# Altium schematic sheet primary_LTC.SchDoc: foxBMS BMS-Slave 12-Cell
size A3; DocumentNumber: 15; SheetNumber: 15; SheetTotal: 21; AUTHOR: Fraunhofer IISB foxBMS Team; SheetDescription: Primary LTC6811
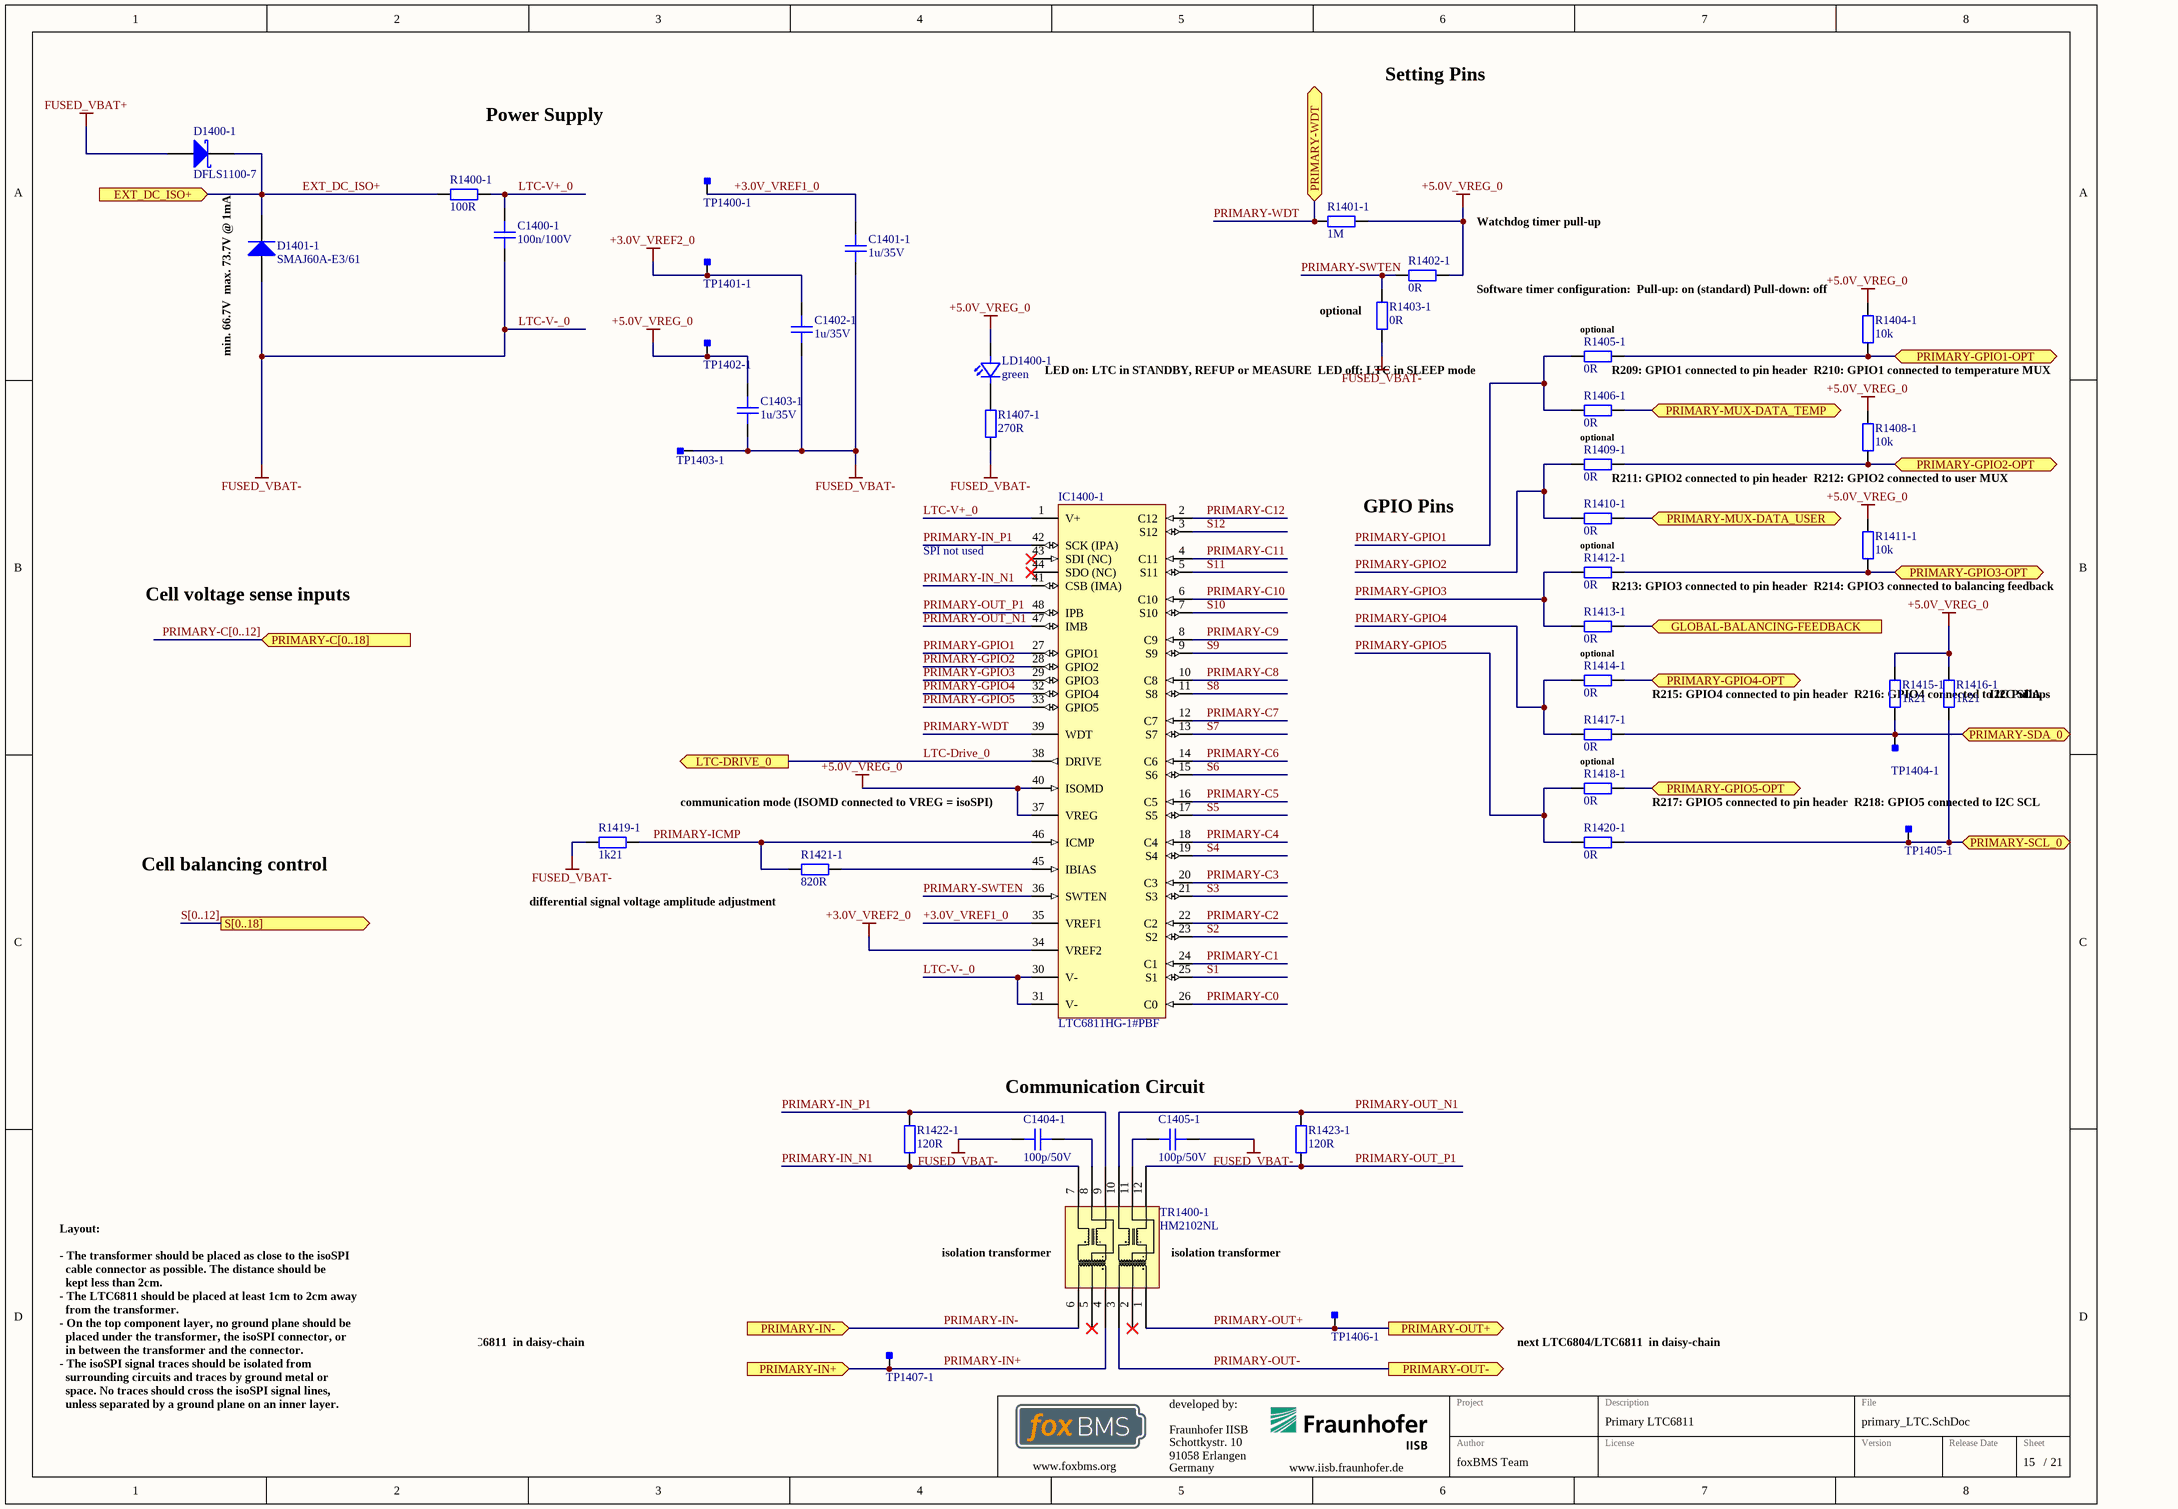
[diagram p0: primary_LTC.SchDoc]

## Parts
C1400-1  100n/100V  [CAPC2012X14N]
C1401-1  1u/35V  [CAPC1608X08N]
C1402-1  1u/35V  [CAPC1608X08N]
C1403-1  1u/35V  [CAPC1608X08N]
C1404-1  100p/50V  [CAPC1608X08N]
C1405-1  100p/50V  [CAPC1608X08N]
D1400-1  DFLS1100-7  [DIOD-POWERDI123-2_V]
D1401-1  SMAJ60A-E3/61  [VISH-DO-214AC-2_N]
IC1400-1  LTC6811HG-1#PBF  [LT-G-48_L]
LD1400-1  green  [LEDC1608X07N]
R1400-1  100R  [RESC2012X05N]
R1401-1  1M  [RESC1608X05N]
R1402-1  0R  [RESC1608X05N]
R1403-1  0R  [RESC1608X05N]
R1404-1  10k  [RESC1608X05N]
R1405-1  0R  [RESC1608X05N]
R1406-1  0R  [RESC1608X05N]
R1407-1  270R  [RESC1608X05N]
R1408-1  10k  [RESC1608X05N]
R1409-1  0R  [RESC1608X05N]
R1410-1  0R  [RESC1608X05N]
R1411-1  10k  [RESC1608X05N]
R1412-1  0R  [RESC1608X05N]
R1413-1  0R  [RESC1608X05N]
R1414-1  0R  [RESC1608X05N]
R1415-1  1k21  [RESC1608X05N]
R1416-1  1k21  [RESC1608X05N]
R1417-1  0R  [RESC1608X05N]
R1418-1  0R  [RESC1608X05N]
R1419-1  1k21  [RESC1608X05N]
R1420-1  0R  [RESC1608X05N]
R1421-1  820R  [RESC1608X05N]
R1422-1  120R  [RESC1608X05N]
R1423-1  120R  [RESC1608X05N]
TP1400-1  Testpoint_Square  [Testpoint_S1]  (value not drawn)  (no BOM)
TP1401-1  Testpoint_Square  [Testpoint_S1]  (value not drawn)  (no BOM)
TP1402-1  Testpoint_Square  [Testpoint_S1]  (value not drawn)  (no BOM)
TP1403-1  Testpoint_Square  [Testpoint_S1]  (value not drawn)  (no BOM)
TP1404-1  Testpoint_Square  [Testpoint_S1]  (value not drawn)  (no BOM)
TP1405-1  Testpoint_Square  [Testpoint_S1]  (value not drawn)  (no BOM)
TP1406-1  Testpoint_Square  [Testpoint_S1]  (value not drawn)  (no BOM)
TP1407-1  Testpoint_Square  [Testpoint_S1]  (value not drawn)  (no BOM)
TR1400-1  HM2102NL  [HM2102NL]

## Ports
EXT_DC_ISO+ (in), GLOBAL-BALANCING-FEEDBACK (in), LTC-DRIVE_0 (out), PRIMARY-C[0..18] (in), PRIMARY-GPIO1-OPT (bidir), PRIMARY-GPIO2-OPT (bidir), PRIMARY-GPIO3-OPT (bidir), PRIMARY-GPIO4-OPT (bidir), PRIMARY-GPIO5-OPT (bidir), PRIMARY-IN+ (in), PRIMARY-IN- (in), PRIMARY-MUX-DATA_TEMP (bidir), PRIMARY-MUX-DATA_USER (bidir), PRIMARY-OUT+ (out), PRIMARY-OUT- (out), PRIMARY-SCL_0 (bidir), PRIMARY-SDA_0 (bidir), PRIMARY-WDT (bidir), S[0..18] (out)

## Nets
+3.0V_VREF2_0: C1402-1.2 IC1400-1.34(VREF2) TP1401-1.1
+5.0V_VREG_0: C1403-1.2 IC1400-1.37(VREG) IC1400-1.40(ISOMD) LD1400-1.2(A) R1401-1.2 R1402-1.2 R1404-1.2 R1408-1.2 R1411-1.2 R1415-1.2 R1416-1.2 TP1402-1.1
FUSED_VBAT+: D1400-1.1(A)
LTC-V-_0: C1400-1.2 C1401-1.1 C1402-1.1 C1403-1.1 C1404-1.1 C1405-1.1 D1401-1.2(A) IC1400-1.30(V-) IC1400-1.31(V-) R1403-1.1 R1407-1.1 R1419-1.1 TP1403-1.1  [also labelled FUSED_VBAT-]
+3.0V_VREF1_0: C1401-1.2 IC1400-1.35(VREF1) TP1400-1.1
EXT_DC_ISO+: D1400-1.2(K) D1401-1.1(K) R1400-1.1 ; port EXT_DC_ISO+
GLOBAL-BALANCING-FEEDBACK: R1413-1.1 ; port GLOBAL-BALANCING-FEEDBACK
LTC-Drive_0: IC1400-1.38(DRIVE) ; port LTC-DRIVE_0
LTC-V+_0: C1400-1.1 IC1400-1.1(V+) R1400-1.2
PRIMARY-C0: IC1400-1.26(C0)
PRIMARY-C1: IC1400-1.24(C1)
PRIMARY-C2: IC1400-1.22(C2)
PRIMARY-C3: IC1400-1.20(C3)
PRIMARY-C4: IC1400-1.18(C4)
PRIMARY-C5: IC1400-1.16(C5)
PRIMARY-C6: IC1400-1.14(C6)
PRIMARY-C7: IC1400-1.12(C7)
PRIMARY-C8: IC1400-1.10(C8)
PRIMARY-C9: IC1400-1.8(C9)
PRIMARY-C10: IC1400-1.6(C10)
PRIMARY-C11: IC1400-1.4(C11)
PRIMARY-C12: IC1400-1.2(C12)
PRIMARY-GPIO1: IC1400-1.27(GPIO1) R1405-1.2 R1406-1.2
PRIMARY-GPIO1-OPT: R1404-1.1 R1405-1.1 ; port PRIMARY-GPIO1-OPT
PRIMARY-GPIO2: IC1400-1.28(GPIO2) R1409-1.2 R1410-1.2
PRIMARY-GPIO2-OPT: R1408-1.1 R1409-1.1 ; port PRIMARY-GPIO2-OPT
PRIMARY-GPIO3: IC1400-1.29(GPIO3) R1412-1.2 R1413-1.2
PRIMARY-GPIO3-OPT: R1411-1.1 R1412-1.1 ; port PRIMARY-GPIO3-OPT
PRIMARY-GPIO4: IC1400-1.32(GPIO4) R1414-1.2 R1417-1.2
PRIMARY-GPIO4-OPT: R1414-1.1 ; port PRIMARY-GPIO4-OPT
PRIMARY-GPIO5: IC1400-1.33(GPIO5) R1418-1.2 R1420-1.2
PRIMARY-GPIO5-OPT: R1418-1.1 ; port PRIMARY-GPIO5-OPT
PRIMARY-ICMP: IC1400-1.46(ICMP) R1419-1.2 R1421-1.1
PRIMARY-IN+: TP1407-1.1 TR1400-1.4 ; port PRIMARY-IN+
PRIMARY-IN-: TR1400-1.6 ; port PRIMARY-IN-
PRIMARY-IN_N1: IC1400-1.41(CSB_(IMA)) R1422-1.2 TR1400-1.7
PRIMARY-IN_P1: IC1400-1.42(SCK_(IPA)) R1422-1.1 TR1400-1.9
PRIMARY-MUX-DATA_TEMP: R1406-1.1 ; port PRIMARY-MUX-DATA_TEMP
PRIMARY-MUX-DATA_USER: R1410-1.1 ; port PRIMARY-MUX-DATA_USER
PRIMARY-OUT+: TP1406-1.1 TR1400-1.1 ; port PRIMARY-OUT+
PRIMARY-OUT-: TR1400-1.3 ; port PRIMARY-OUT-
PRIMARY-OUT_N1: IC1400-1.47(IMB) R1423-1.2 TR1400-1.10
PRIMARY-OUT_P1: IC1400-1.48(IPB) R1423-1.1 TR1400-1.12
PRIMARY-SCL_0: R1416-1.1 R1420-1.1 TP1405-1.1 ; port PRIMARY-SCL_0
PRIMARY-SDA_0: R1415-1.1 R1417-1.1 TP1404-1.1 ; port PRIMARY-SDA_0
PRIMARY-SWTEN: IC1400-1.36(SWTEN) R1402-1.1 R1403-1.2
PRIMARY-WDT: IC1400-1.39(WDT) R1401-1.1 ; port PRIMARY-WDT
S1: IC1400-1.25(S1)
S2: IC1400-1.23(S2)
S3: IC1400-1.21(S3)
S4: IC1400-1.19(S4)
S5: IC1400-1.17(S5)
S6: IC1400-1.15(S6)
S7: IC1400-1.13(S7)
S8: IC1400-1.11(S8)
S9: IC1400-1.9(S9)
S10: IC1400-1.7(S10)
S11: IC1400-1.5(S11)
S12: IC1400-1.3(S12)
NetC1404-1_2: C1404-1.2 TR1400-1.8
NetC1405-1_2: C1405-1.2 TR1400-1.11
NetIC1400-1_45: IC1400-1.45(IBIAS) R1421-1.2
NetLD1400-1_1: LD1400-1.1(C) R1407-1.2

Not connected (* = marked no-connect by the designer): IC1400-1 43(SDI_(NC))* 44(SDO_(NC))*; TR1400-1 2* 5*

## Buses and harness runs
bus PRIMARY-C[0..12] = port PRIMARY-C[0..18]
bus S[0..12] = port S[0..18]

## Notes on the sheet
- Setting Pins
- Power Supply
- Watchdog timer pull-up
- min. 66.7V
  max. 73.7V @ 1mA
- (near R1403-1) optional
- (near R1404-1) Software timer configuration:
  Pull-up: on (standard)
  Pull-down: off
- LED on: LTC in STANDBY, REFUP or MEASURE
  LED off: LTC in SLEEP mode
- (near R1405-1) optional
- (near R1405-1) R209: GPIO1 connected to pin header
  R210: GPIO1 connected to temperature MUX
- optional
- GPIO Pins
- (near R1409-1) R211: GPIO2 connected to pin header
  R212: GPIO2 connected to user MUX
- SPI not used
- (near R1412-1) R213: GPIO3 connected to pin header
  R214: GPIO3 connected to balancing feedback
- Cell voltage sense inputs
- R215: GPIO4 connected to pin header
  R216: GPIO4 connected to I2C SDA
- (near R1416-1) I2C Pullups
- communication mode (ISOMD connected to VREG = isoSPI)
- (near TP1405-1) R217: GPIO5 connected to pin header
  R218: GPIO5 connected to I2C SCL
- Cell balancing control
- (near R1421-1) differential signal voltage amplitude adjustment
- Communication Circuit
- (near TR1400-1) isolation transformer
- previous LTC6804/LTC6811
  in daisy-chain
- next LTC6804/LTC6811
  in daisy-chain
- Layout:
  - The transformer should be placed as close to the isoSPI
  cable connector as possible. The distance should be
  kept less than 2cm.
  - The LTC6811 should be placed at least 1cm to 2cm away
  from the transformer.
  - On the top component layer, no ground plane should be
  placed under the transformer, the isoSPI connector, or
  in between the transformer and the connector.
  - The isoSPI signal traces should be isolated from
  surrounding circuits and traces by ground metal or
  space. No traces should cross the isoSPI signal lines,
  unless separated by a ground plane on an inner layer.
- Fraunhofer IISB
- Schottkystr. 10
- developed by:
- 91058 Erlangen
- Germany
- Author
- Project
- License
- Description
- File
- Version
- Release Date
- Sheet
- www.foxbms.org
- www.iisb.fraunhofer.de
- foxBMS Team
- /

## Library data of the parts
C1400-1 = gen_C_ceramic_100n_100V_X7R_0805: MLCC; Capacitance: 100n; Rated Voltage: 100V; Dielectric: X7R; Case EIA: 0805; Case Metric: 2012; Automotive Qualified: False; Part Number: gen_C_ceramic_100n_100V_X7R_0805; Supplier 1: Farnell; Supplier Part Number 1: 2320821
C1401-1 C1402-1 C1403-1 = gen_C_ceramic_1u_35V_X7R_0603: MLCC; Capacitance: 1u; Rated Voltage: 35V; Dielectric: X7R; Case EIA: 0603; Case Metric: 1608; PnP Package: C_0603_10; PnP Value: 1uF/35V/X7R; PnP equipped: x; Automotive Qualified: False; Part Number: gen_C_ceramic_1u_35V_X7R_0603; Supplier 1: Farnell; Supplier Part Number 1: 1907508
C1404-1 C1405-1 = gen_C_ceramic_100p_50V_C0G_0603: MLCC; Capacitance: 100p; Rated Voltage: 50V; Dielectric: C0G; Case EIA: 0603; Case Metric: 1608; Automotive Qualified: False; Part Number: gen_C_ceramic_100p_50V_C0G_0603; Supplier 1: Farnell; Supplier Part Number 1: 1414603
D1400-1 = CMP-2000-05099-1: 1 A High Voltage Schottky Barrier Rectifier, 0.62 V, -55 to 175 degC, 2- Pin POWERDI123, Pb-Free, Tape and Reel; Manufacturer: Diodes Inc; Average Rectified Current-Max: 1A; Peak Current-Max: 40A; Forward Voltage: 0.77V; Reverse Current-Max: 1µA; Reverse Voltage-Max [Vrrm]: 100V; Datasheet Version: Sep-14; Datasheet URL: https://datasheet.ciiva.com/15144/getdatasheetpartid-44146-15144126.pdf; Manufacturer URL: http://www.diodes.com/
D1401-1 = CMP-0548-00258-2: Transient Voltage Suppressor, 6.40 to 231 V, 60 V Stand-off Voltage, Uni-Directional, -55 to 155 degC, 2-pin DO-214AC, Pb-Free, Tape and Reel; Manufacturer: Vishay Semiconductor; VWM (V): 60; PPPM (W): 400, 300; VBR Uni-Directional (V): 6.4 to 231; IFSM: 40 A; ID (uA): 1; RoHS: TRUE; ComponentLink3Description: Package Specification; PackageReference: DO-214AC-2; PartNumber: SMAJ60A-E3/61; ComponentLink2Description: Datasheet; ComponentLink2URL: http://www.vishay.com/docs/88390/smaj50a.pdf; ComponentLink3URL: http://www.vishay.com/docs/88390/smaj50a.pdf; Packing: Tape and Reel; ComponentLink1Description: Manufacturer URL; PackageDescription: 2-Pin DO-214AC (SMA), Body 4.245 x 2.665 mm; DatasheetVersion: 12/8/2013; ComponentLink1URL: http://www.vishay.com/; Operating Junction and Storage Temperature Range: -55 to 150 degC; Mounting Technology: Surface Mount
IC1400-1 = LTC6811HG-1#PBF: Multicell Battery Monitor, 60 V Vin MAX, 48-pin SOP (G-48), -40 to 125 degC, Pb-Free; Manufacturer: Linear Technology; Type of Charger: Battery Stack Monitor; Vin Max(V): 60; Battery Chemistry: Li-Ion, Li-Polymer, NiMH; Number of Cells: > 1000 V of stacked Li-Ion cells; Automotive Qualified: False; RoHS: TRUE; ComponentLink1Description: Datasheet; ComponentLink1URL: https://cds.linear.com/docs/en/datasheet/68111fb.pdf; PartNumber: LTC6811HG-1#PBF; PackageReference: G-48; PackageVersion: Rev. Ã˜, 01/2011; ComponentLink2Description: Datasheet; Mounting Technology: Surface Mount; ComponentLink3Description: Package Specification; PackageDescription: 48-Pin Plastic SSOP, Body 12.8 x 5.3 mm, Pitch 0.5 mm; ComponentLink3URL: http://cds.linear.com/docs/en/packaging/05081887_0_G48.pdf; ComponentLink2URL: http://cds.linear.com/docs/en/datasheet/680412f.pdf; Part Number: LTC6811HG-1#PBF; Part Name: LTC6811HG-1#PBF; Operating Temperature: -40°C - +125°C; Supplier 1: Digikey; Supplier Part Number 1: LTC6811HG-1#PBF-ND
LD1400-1 = gen_LED_0603_green: LED; Breakdown Voltage: 5V; Continuous Forward Current: 20mA; Forward Voltage @ 20mA: 2.2V; Automotive Qualified: False; Part Number: gen_LED_0603_green; Color: green; Supplier 1: Farnell; Supplier Part Number 1: 2099223; PnP Package: LED_0603
R1400-1 = gen_R_100R_0805: SMD Resistor 100R 0805; Tolerance: 1%; Power: 0.125W; Case EIA: 0805; Case Metric: 2012; Maximum Working Voltage: 150V; PnP Package: R_0805; Automotive Qualified: False; Part Number: gen_R_100R_0805; Operating Temperature: -55°C - +155°C; Resistance: 100R; Series: E24, E96; PnP Value: 100R; Supplier 1: Farnell; Supplier Part Number 1: 1469862
R1401-1 = gen_R_1M_0603: SMD Resistor 1M 0603; Tolerance: 1%; Power: 0.1W; Case EIA: 0603; Case Metric: 1608; Maximum Working Voltage: 75V; PnP Package: R_0603; Automotive Qualified: False; Part Number: gen_R_1M_0603; Operating Temperature: -55°C - +155°C; Resistance: 1M; Series: E24, E96; PnP Value: 1M; Supplier 1: Farnell; Supplier Part Number 1: 1469746
R1402-1 R1403-1 R1405-1 R1406-1 R1409-1 R1410-1 R1412-1 R1413-1 R1414-1 R1417-1 R1418-1 R1420-1 = gen_R_0R_0603: SMD Resistor 0R 0603; Power: 0.1W; Case EIA: 0603; Case Metric: 1608; Maximum Working Voltage: 75V; PnP Package: R_0603; Automotive Qualified: False; Part Number: gen_R_0R_0603; Operating Temperature: -55°C - +155°C; Resistance: 0R; Series: Jumper; PnP Value: 0R; Supplier 1: Farnell; Supplier Part Number 1: 2073345
R1404-1 R1408-1 R1411-1 = gen_R_10k_0603: SMD Resistor 10k 0603; Tolerance: 1%; Power: 0.1W; Case EIA: 0603; Case Metric: 1608; Maximum Working Voltage: 75V; PnP Package: R_0603; Automotive Qualified: True; Part Number: gen_R_10k_0603; Operating Temperature: -55°C - +155°C; Resistance: 10k; Series: E24, E96; PnP Value: 10k; Supplier 1: Farnell; Supplier Part Number 1: 2073349
R1407-1 = gen_R_270R_0603: SMD Resistor 270R 0603; Tolerance: 1%; Power: 0.1W; Case EIA: 0603; Case Metric: 1608; Maximum Working Voltage: 75V; PnP Package: R_0603; Automotive Qualified: False; Part Number: gen_R_270R_0603; Operating Temperature: -55°C - +155°C; Resistance: 270R; Series: E24; PnP Value: 270R; Supplier 1: Farnell; Supplier Part Number 1: 2141320
R1415-1 R1416-1 R1419-1 = gen_R_1k21_0603: SMD Resistor 1k21 0603; Tolerance: 1%; Power: 0.1W; Case EIA: 0603; Case Metric: 1608; Maximum Working Voltage: 75V; PnP Package: R_0603; Automotive Qualified: False; Part Number: gen_R_1k21_0603; Operating Temperature: -55°C - +155°C; Resistance: 1k21; Series: E96; PnP Value: 1k21; Supplier 1: Farnell; Supplier Part Number 1: 1652852
R1421-1 = gen_R_820R_0603: SMD Resistor 820R 0603; Tolerance: 1%; Power: 0.1W; Case EIA: 0603; Case Metric: 1608; Maximum Working Voltage: 75V; PnP Package: R_0603; Automotive Qualified: False; Part Number: gen_R_820R_0603; Operating Temperature: -55°C - +155°C; Resistance: 820R; Series: E24; PnP Value: 820R; Supplier 1: Farnell; Supplier Part Number 1: 1469841
R1422-1 R1423-1 = gen_R_120R_0603: SMD Resistor 120R 0603; Tolerance: 1%; Power: 0.1W; Case EIA: 0603; Case Metric: 1608; Maximum Working Voltage: 75V; PnP Package: R_0603; Automotive Qualified: False; Part Number: gen_R_120R_0603; Operating Temperature: -55°C - +155°C; Resistance: 120R; Series: E24; PnP Value: 120R; Supplier 1: Farnell; Supplier Part Number 1: 2073369
TP1400-1 TP1401-1 TP1402-1 TP1403-1 TP1404-1 TP1405-1 TP1406-1 TP1407-1 = Testpoint_Square: Testpoint, square; Part Number: Testpoint_Square
TR1400-1 = HM2102NL: Pulse HM2102NL BMS Transformer; Automotive Qualified: True; Part Number: HM2102NL; Manufacturer: Pulse; Operating Temperature: -40°C - +125°C; ComponentLink1Description: Datasheet; ComponentLink1URL: https://www.mouser.com/ds/2/336/HM2102NL-1218600.pdf; Supplier 1: Mouser; Supplier Part Number 1: 673-HM2102NL; Supplier 2: Digikey; Supplier Part Number 2: 1840-1034-1-ND